# Altium schematic sheet DAC.Schematic.SchDoc
size A
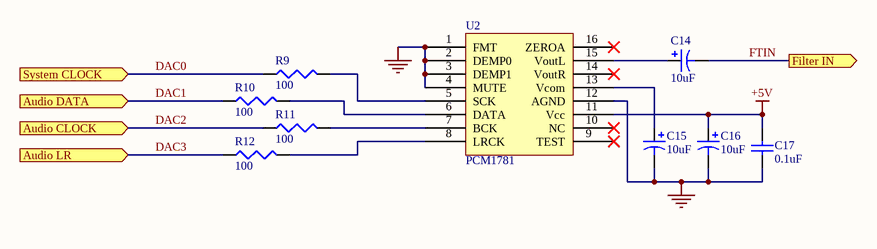
[diagram p0: DAC.Schematic.SchDoc]

## Parts
C14  10uF  [RB7.6-15]
C15  10uF  [RB7.6-15]
C16  10uF  [RB7.6-15]
C17  0.1uF  [C1206]
R9  100  [J1-0603]
R10  100  [J1-0603]
R11  100  [J1-0603]
R12  100  [J1-0603]
U2  PCM1781  [PCM1781]

## Ports
Audio CLOCK (in), Audio DATA (in), Audio LR (in), Filter IN (out), System CLOCK (in)

## Nets
+5V: C16.1 C17.2 U2.11(Vcc)
NetC15_2: C15.2 C16.2 C17.1 U2.1(FMT) U2.2(DEMP0) U2.3(DEMP1) U2.4(MUTE) U2.12(AGND)
DAC0: R9.1 ; port System CLOCK
DAC1: R10.1 ; port Audio DATA
DAC2: R11.1 ; port Audio CLOCK
DAC3: R12.1 ; port Audio LR
FTIN: C14.2 ; port Filter IN
NetC14_1: C14.1 U2.15(VoutL)
NetC15_1: C15.1 U2.13(Vcom)
NetR9_2: R9.2 U2.5(SCK)
NetR10_2: R10.2 U2.6(DATA)
NetR11_2: R11.2 U2.7(BCK)
NetR12_2: R12.2 U2.8(LRCK)

Not connected (* = marked no-connect by the designer): U2 9(TEST)* 10(NC)* 14(VoutR)* 16(ZEROA)*

## Library data of the parts
C14-C16 = Cap Pol1: Polarized Capacitor (Radial); Published: 8-Jun-2000; LatestRevisionDate: 17-Jul-2002; LatestRevisionNote: Re-released for DXP Platform.; PackageReference: RB7.6-15; Publisher: Altium Limited; PackageDescription: Polarized Capacitor (Radial); 2 Leads; Value: 10uF
C17 = Cap Semi: Capacitor (Semiconductor SIM Model); Value: 0.1u; Published: 8-Jun-2000; LatestRevisionDate: 29-May-2009; LatestRevisionNote: IPC-7351 Footprint Added.; PackageReference: C1206; Publisher: Altium Limited; PackageDescription: Chip Capacitor
R9-R12 = Res3: Resistor; Published: 8-Jun-2000; LatestRevisionDate: 29-May-2009; LatestRevisionNote: IPC-7351 Footprint Added.; PackageReference: J1-0603; Publisher: Altium Limited; PackageDescription: Chip Resistor; Value: 100
U2 = PCM1781 DAC